# EAGLE schematic RadioAdapterBoard (EAGLE 7.3.0)
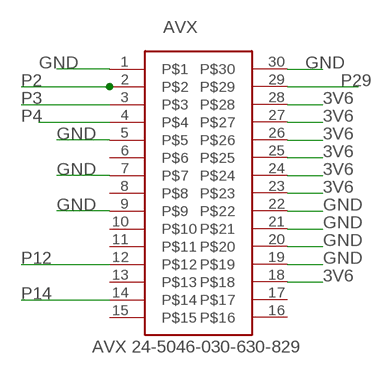
[diagram p0: schematic, sheet 1]

## Parts
AVX  AVX-24-5046-030-630-829  [AVX-24-5046-630-829]

## Nets
3V6: AVX.18 AVX.23 AVX.24 AVX.25 AVX.26 AVX.27 AVX.28
GND: AVX.1 AVX.5 AVX.7 AVX.9 AVX.19 AVX.20 AVX.21 AVX.22 AVX.30
P2: AVX.2
P3: AVX.3
P4: AVX.4
P12: AVX.12
P14: AVX.14
P29: AVX.29
Unconnected: AVX.6 AVX.8 AVX.10 AVX.11 AVX.13 AVX.15 AVX.16 AVX.17

## Library data of the parts
AVX = CNTRL_BOARD:AVX-24-5046-030-630-829